# EAGLE design monsterbadge (EAGLE 5.12)
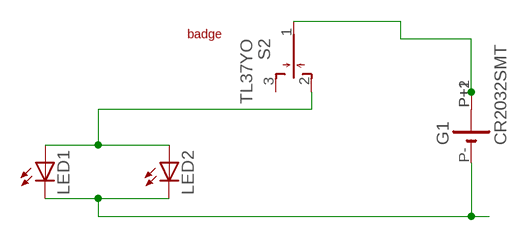
[diagram p0: schematic, sheet 1]

## Parts
G1  CR2032SMT  [CR2032-SMT]
LED1  LED5MM  [LED5MM]
LED2  LED5MM  [LED5MM]
S2  TL37YO  [TL3XYO]
U$1  BADGEPIN  [BADGEPIN]

## Nets
0V: G1.P-(-) LED1.K(C) LED2.K(C)
+3V: LED1.A LED2.A S2.2(O1)
N$3: G1.P+1(+) G1.P+2(+1) S2.1(C)
Unconnected: S2.3(O2)

## Library data of the parts
G1 = matt:CR2032: NC ACCU Varta
LED1 LED2 = matt led:LED: LED OSRAM: - CHIPLED LG R971, LG N971, LY N971, LG Q971, LY Q971, LO R971, LY R971 LH N974, LH R974 LS Q976, LO Q976, LY Q976 LO Q996 - Hyper CHIPLED LW Q18S LB Q993, LB Q99A, LB R99A - SideLED LS A670, LO A670, LY A670, LG A670, LP A670 LB A673, LV A673, LT A673, LW A673 LH A674 LY A675 LS A676, LA A676, LO A676, LY A676, LW A676 LS A679, LY A679, LG A679 - Hyper Micro SIDELED® LS Y876, LA Y876, LO Y876, LY Y876 LT Y87S - SmartLED LW L88C, LW L88S LB L89C, LB L89S, LG L890 LS L89K, LO L89K, LY L89K LS L896, LA L896, LO L896, LY L896 - TOPLED LS T670, LO T670, LY T670, LG T670, LP T670 LSG T670, LSP T670, LSY T670, LOP T670, LYG T670 LG T671, LOG T671, LSG T671 LB T673, LV T673, LT T673, LW T673 LH T674 LS T676, LA T676, LO T676, LY T676, LB T676, LH T676, LSB T676, LW T676 LB T67C, LV T67C, LT T67C, LS T67K, LO T67K, LY T67K, LW E67C LS E67B, LA E67B, LO E67B, LY E67B, LB E67C, LV E67C, LT E67C LW T67C LS T679, LY T679, LG T679 LS T770, LO T770, LY T770, LG T770, LP T770 LB T773, LV T773, LT T773, LW T773 LH T774 LS E675, LA E675, LY E675, LS T675 LS T776, LA T776, LO T776, LY T776, LB T776 LHGB T686 LT T68C, LB T68C - Hyper Mini TOPLED® LB M676 - Mini TOPLED Santana® LG M470 LS M47K, LO M47K, LY M47K Source: http://www.osram.convergy.de LUXEON: - LUMILED® LXK2-PW12-R00, LXK2-PW12-S00, LXK2-PW14-U00, LXK2-PW14-V00 LXK2-PM12-R00, LXK2-PM12-S00, LXK2-PM14-U00 LXK2-PE12-Q00, LXK2-PE12-R00, LXK2-PE12-S00, LXK2-PE14-T00, LXK2-PE14-U00 LXK2-PB12-K00, LXK2-PB12-L00, LXK2-PB12-M00, LXK2-PB14-N00, LXK2-PB14-P00, LXK2-PB14-Q00 LXK2-PR12-L00, LXK2-PR12-M00, LXK2-PR14-Q00, LXK2-PR14-R00 LXK2-PD12-Q00, LXK2-PD12-R00, LXK2-PD12-S00 LXK2-PH12-R00, LXK2-PH12-S00 LXK2-PL12-P00, LXK2-PL12-Q00, LXK2-PL12-R00 Source: www.luxeon.com KINGBRIGHT: KA-3528ASYC Source: www.kingbright.com
S2 = matt:TL37YO: TINY SWITCH MOM OFF MOM Source: http://www2.produktinfo.conrad.com/datenblaetter/700000-724999/705152-da-01-de-Subminiaturschalter_TL_36YO.pdf
U$1 = matt:BADGEPIN

## Board
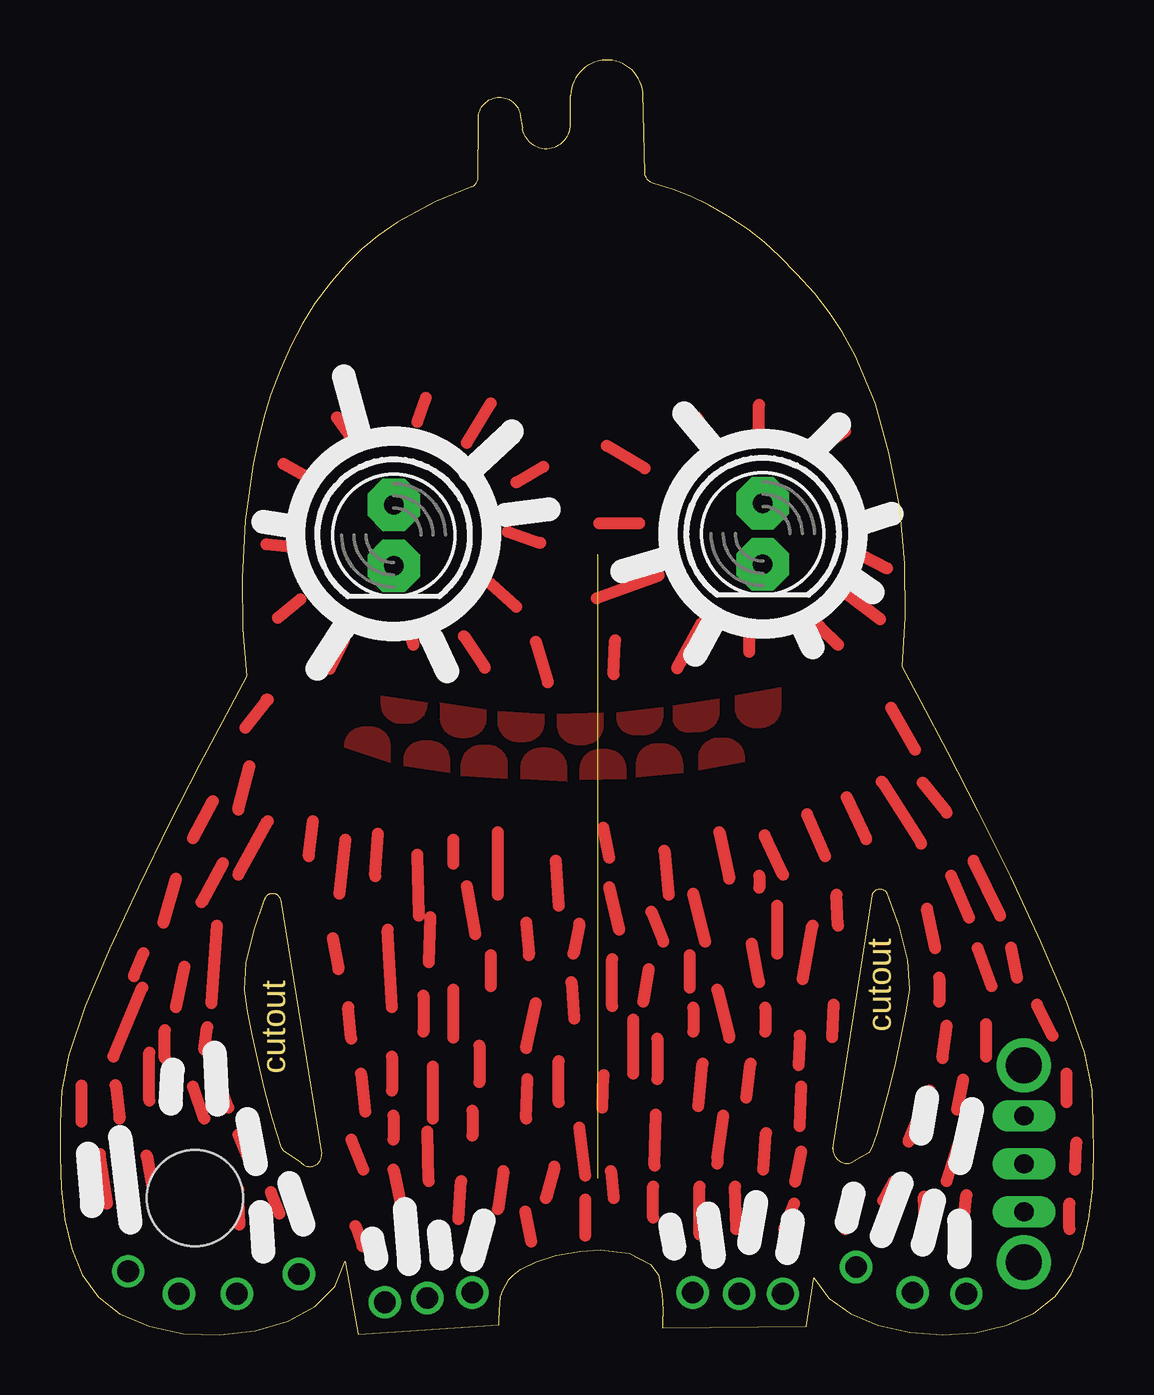
[diagram p1: board, top side]
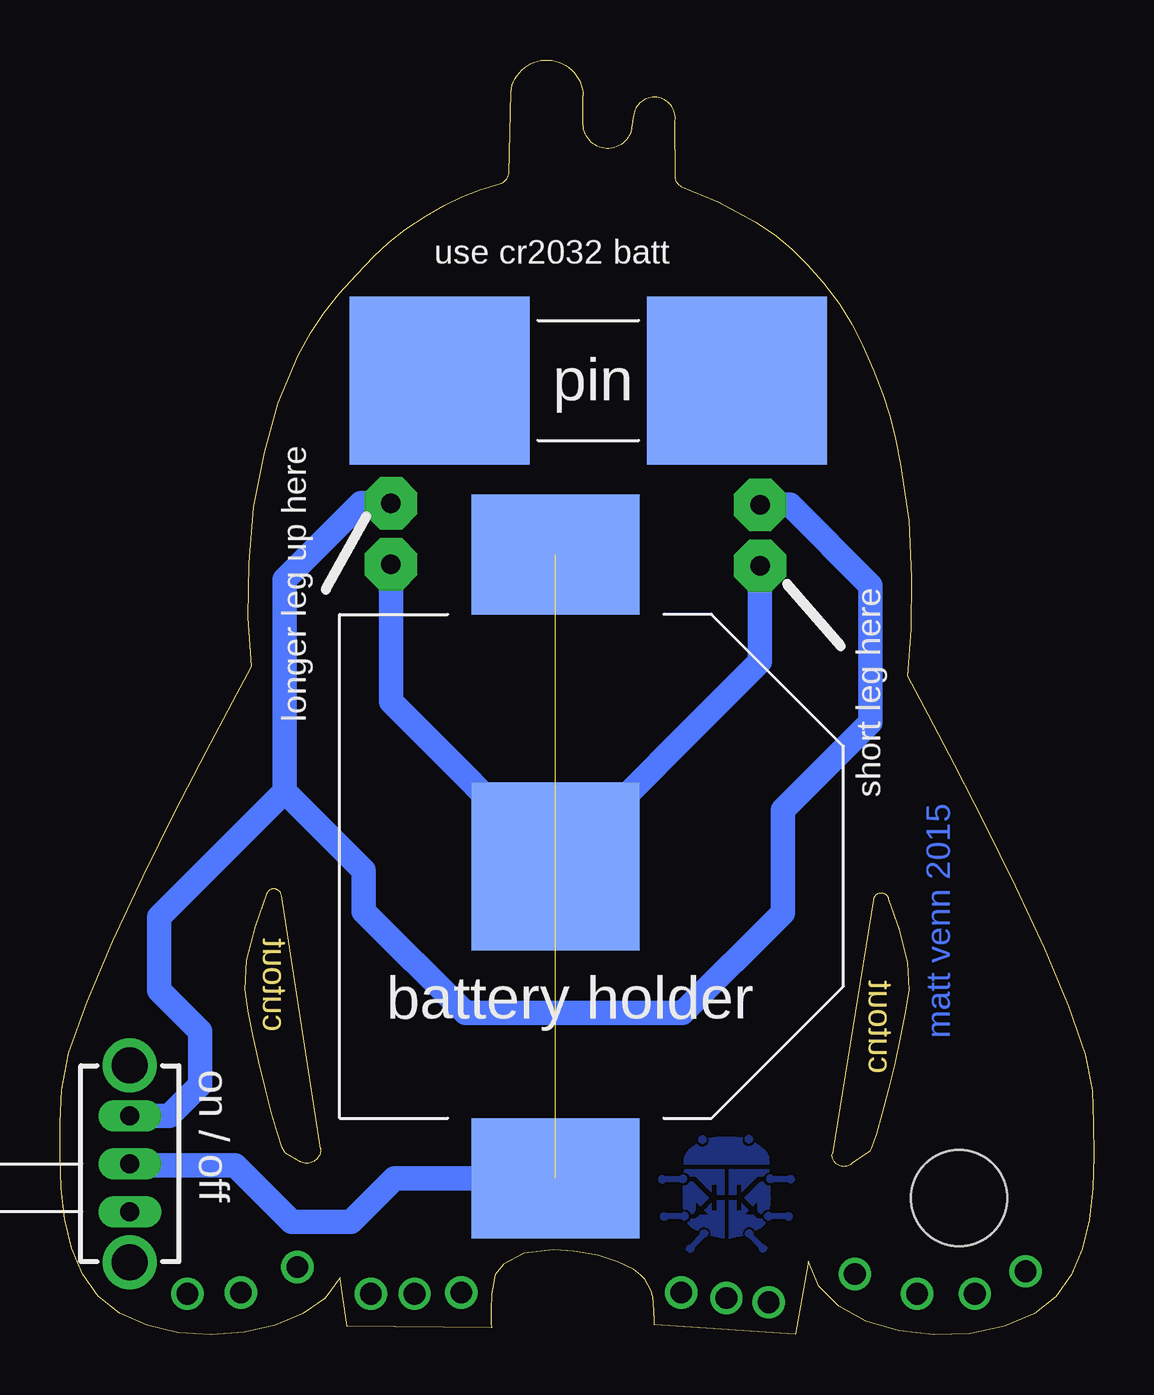
[diagram p2: board, bottom side, seen from below]

Size 43.09 x 53.14 mm. Coordinates in mm from the lower left corner, seen from the top.
Outline: 17.18,47.87 15.66,47.24 14.08,46.39 13.26,45.82 12.58,45.26 11.95,44.64 11.3,43.88 10.61,42.99 10.09,42.14 9.64,41.25 9.18,40.21 8.79,39.2 8.5,38.29 8.28,37.37 8.06,36.3 7.71,33.94 7.6,31.55 7.62,29.43 7.77,27.46 6.92,25.87 5.81,23.76 4.55,21.32 3.27,18.71 2.07,16.11 1.06,13.71 0.35,11.68 0.07,10.2 0.02,8.84 0,7.47 0.05,6.11 0.2,4.81 0.48,3.6 0.93,2.51 1.59,1.6 2.49,0.89 3.74,0.35 5.16,0.06 6.66,0 8.13,0.17 9.49,0.57 10.63,1.19 11.46,2.02 11.89,3.06 12.43,0.02 18.31,0.43 18.31,0.6 18.32,1.04 18.37,1.6 18.46,1.87 18.71,2.32 18.88,2.5 19.19,2.73 19.84,3.05 20.68,3.33 21.68,3.49 22.52,3.54 23.74,3.41 24.61,2.95 24.95,2.52 25.1,1.69 25.13,1.04 25.12,0.52 25.11,0.3 31.11,0.35 31.42,2.38 32.05,1.54 32.97,0.88 34.12,0.4 35.42,0.1 36.79,0.01 38.16,0.1 39.46,0.4 40.6,0.9 41.5,1.61 42.16,2.53 42.61,3.61 42.89,4.82 43.04,6.12 43.09,7.48 43.08,8.85 43.03,10.21 42.72,11.76 41.97,13.89 40.9,16.41 39.63,19.12 38.29,21.82 37.01,24.31 35.91,26.39 35.1,27.87 35.24,29.93 35.22,32.15 35.01,34.48 34.56,36.78 34,38.85 33.16,40.82 32.62,41.8 32.08,42.62 31.46,43.4 30.71,44.23 30.02,44.95 29.37,45.54 28.68,46.09 27.85,46.63 27.06,47.09 26.33,47.45 25.57,47.74 24.7,48
Outline: 33.06,7.21 33.72,7.58 33.85,7.83 34.04,8.41 34.28,9.24 34.55,10.25 34.82,11.35 35.06,12.46 35.27,13.51 35.41,14.41 35.33,15.61 34.96,17.03 34.47,18.4 arc149 33.86,18.32 32.22,7.77
Outline: 10.04,7.19 9.31,7.69 9.24,7.81 9.05,8.39 8.81,9.22 8.54,10.23 8.28,11.33 8.03,12.44 7.83,13.49 7.69,14.39 7.75,15.51 8.09,16.85 8.54,18.16 arc-3 8.55,18.21 arc-148 9.19,18.14 10.9,7.55
Outline: 10.04,7.19 arc142 10.91,7.53
Outline: 32.22,7.77 arc116 33.06,7.21
Outline: 17.18,47.86 arc51 17.43,48.19
Outline: 24.7,48 arc-51 24.38,48.39
Outline: 17.43,48.21 17.45,50.61 arc-180 19.19,50.82
Outline: 24.38,48.4 24.3,51.79 arc173 21.29,51.66
Outline: 19.18,50.83 19.27,50.3
Outline: 19.26,50.27 arc173 21.28,50.56
Outline: 21.29,50.57 21.29,51.65
Copper layers (1*16): Top 0.035mm / dielectric 1.5mm / Bottom 0.035mm
Design rules "default": minimum track width 10mil, minimum drill 24mil, track to track 8mil, track to pad 8mil, pad to pad 8mil, via to via 8mil, smd to smd 8mil, copper to edge 40mil, drill to drill 8mil, minimum pad ring 10mil, minimum via ring 8mil, stop-mask expansion 4mil, vias tented up to drill 0mil, thermal gap 10mil
Holes 4 mm at 5.62,5.71

### Footprints (pad centres in the part's own frame; a part is rotated, then mirrored left to right if it is on the bottom)
CR2032-SMT = smd 5 x 7: P+1 -13,0; P+2 13,0 | smd 7 x 7: P- 0,0
LED5MM = drill 0.813 pad 2.184 octagon: A -1.27,0; K 1.27,0
TL3XYO = drill 0.8 long: 1 0,0; 2 -2,0; 3 2,0 | drill 1.5 round: P$4 4.1,0; P$5 -4.1,0
BADGEPIN = smd 7.5 x 7: P$1 -6.1,0; P$2 6.3,0

### Placement (x,y rotation side)
G1  22.43,19.54 90 bottom
LED1  13.91,33.33 270 top
LED2  29.29,33.4 270 top
S2  40.18,7.14 270 bottom
U$1  21.17,39.78 0 bottom

### Tracks (layer width: path | path; a pad name or v marks a point on that pad's centre or on a via)
0V
  Bottom 1.016: LED1.K 13.91,28.06 G1.P- 29.29,26.4 LED2.K
+3V
  Bottom 1.016: LED2.A 30.54,34.67 33.73,31.48 33.73,22.66 | S2.2 38.54,9.14 37.25,10.42 37.25,12.66 38.96,14.36 38.96,17.42 33.73,22.66 | LED1.A 12.67,34.6 9.31,31.25 9.31,25.54 12.96,21.89 12.96,17.6 17.14,13.42 26.2,13.42 30.43,17.66 30.43,19.36 33.73,22.66
N$1
  Top 0.5: 11.65,18.39 11.9,20.64
N$2
  Top 0.5: 16.4,19.64 16.4,20.64
N$3  (1 unrouted)
  Bottom 1.016: G1.P+1 29.14,6.54 30.96,4.72 33.43,4.72 35.78,7.07 40.11,7.07 S2.1
N$4
  pour Top: 11.84,24.54 arc-90 12.67,25.36 12.96,25.36 arc-90 13.78,24.54 13.78,23.83 11.84,24.48
  pour Top: 15.31,26.3 arc-90 14.49,25.48 14.2,25.48 arc-90 13.37,26.3 13.37,26.66 15.31,26.36
N$5
  pour Top: 14.31,23.95 arc-90 15.14,24.77 15.43,24.77 arc-90 16.25,23.95 16.25,23.42 14.31,23.72
  pour Top: 17.78,25.72 arc-90 16.96,24.89 16.67,24.89 arc-90 15.84,25.72 15.84,26.36 17.78,26.07
N$6
  pour Top: 16.72,23.77 arc-90 17.55,24.6 17.84,24.6 arc-90 18.67,23.77 18.67,23.19 16.72,23.3
  pour Top: 20.2,25.54 arc-90 19.37,24.72 19.08,24.72 arc-90 18.25,25.54 18.25,26.01 20.2,25.89
N$7
  pour Top: 19.2,23.66 arc-90 20.02,24.48 20.31,24.48 arc-90 21.14,23.66 21.14,23.07 19.2,23.19
  pour Top: 22.67,25.42 arc-90 21.84,24.6 21.55,24.6 arc-90 20.72,25.42 20.72,25.89 22.67,25.95
N$8
  pour Top: 21.67,23.6 arc-90 22.49,24.42 22.78,24.42 arc-90 23.61,23.6 23.61,23.19 21.67,23.13
  pour Top: 25.14,25.72 arc-90 24.25,25.01 23.96,25.01 arc-90 23.2,25.72 23.2,25.95 25.14,26.19
N$9
  pour Top: 24.02,23.83 arc-90 24.84,24.66 25.14,24.66 arc-90 25.96,23.83 25.96,23.42 24.02,23.25
  pour Top: 27.49,26.01 arc-90 26.67,25.13 26.31,25.13 arc-90 25.55,25.6 25.55,26.25 27.49,26.54
N$10
  pour Top: 26.61,24.07 arc-90 27.43,24.89 27.72,24.89 arc-90 28.55,24.07 28.55,23.89 26.61,23.54
  pour Top: 30.08,26.25 arc-90 29.25,25.3 28.96,25.3 arc-90 28.14,26.19 28.14,26.66 30.08,27.01
N$11
  Top 0.5: 11.25,27.78 11.84,28.95
N$12
  Top 0.5: 9.08,29.89 10.02,30.66
N$13
  Top 0.5: 9.67,32.83 8.61,32.95
N$14
  Top 0.5: 9.31,36.3 10.25,35.78
N$15
  Top 0.5: 12.14,37.42 11.55,38.25
N$16
  Top 0.5: 14.9,38.07 15.25,39.07
N$17
  Top 0.5: 16.96,37.19 17.96,38.83
N$18
  Top 0.5: 19.02,35.54 20.14,36.19
N$19
  Top 0.5: 18.67,33.48 20.02,33.01
N$20
  Top 0.5: 19.02,30.36 17.96,31.3
N$21
  Top 0.5: 24.37,36.13 22.78,37.07
N$22
  Top 0.5: 27.31,36.83 26.55,38.25
N$23
  Top 0.5: 29.14,37.72 29.14,38.78
N$24
  Top 0.5: 31.73,37.01 32.73,37.66
N$25
  Top 0.5: 33.49,34.07 34.49,34.25
N$26
  Top 0.5: 33.37,32.54 34.49,31.95
N$27
  Top 0.5: 32.67,31.01 34.2,29.83
N$28
  Top 0.5: 31.67,29.54 32.43,28.78
N$29
  Top 0.5: 28.73,29.13 28.73,28.48
N$30
  Top 0.5: 25.73,27.79 26.78,29.72
N$31
  Top 0.5: 22.37,30.72 24.96,31.66
N$32
  Top 0.5: 16.84,29.13 17.71,27.82
N$33
  Top 0.5: 14.55,29.48 14.72,28.78
N$34
  Top 0.5: 7.43,21.89 7.9,23.72
N$35
  Top 0.5: 10.37,19.95 10.55,21.42
N$36
  Top 0.5: 13.14,19.13 13.25,20.89
N$37
  Top 0.5: 14.96,17.48 14.9,20.01
N$38
  Top 0.5: 18.25,18.36 18.25,20.95
N$39
  Top 0.5: 20.67,19.78 20.78,17.89
N$40
  Top 0.5: 23.31,16.89 22.9,18.66
N$41
  Top 0.5: 25.2,20.19 25.37,18.36
N$42
  Top 0.5: 27.49,20.95 27.9,19.01
N$43
  Top 0.5: 30.14,19.19 29.37,20.83
N$44
  Top 0.5: 31.9,19.95 31.14,21.72
N$45
  Top 0.5: 32.78,22.42 33.61,20.66
N$46
  Top 0.5: 34.25,23.07 35.9,20.48
N$47
  Top 0.5: 36.96,21.78 35.96,23.01
N$48
  Top 0.5: 39.2,17.48 38.08,19.78
N$49
  Top 0.5: 36.49,16.13 36.14,17.78
N$50
  Top 0.5: 38.84,14.54 38.25,16.13
N$51
  Top 0.5: 36.78,11.54 36.96,12.89
N$52
  Top 0.5: 35.37,8.07 36.25,10.19
N$53
  Top 0.5: 36.96,6.42 37.43,7.89
N$54
  Top 0.5: 34.78,6.42 34.31,5.6
N$55
  Top 0.5: 36.08,4.25 36.02,5.77
N$56
  Top 0.5: 41.37,12.48 40.73,13.78
N$57
  Top 0.5: 41.96,9.72 41.96,10.89
N$58
  Top 0.5: 42.31,6.89 42.37,8.01
N$59
  Top 0.5: 38.61,11.6 38.61,12.95
N$60
  Top 0.5: 37.55,3.54 37.78,5.83
N$61
  Top 0.5: 32.73,4.42 33.02,5.83
N$62
  Top 0.5: 42.08,4.42 42.08,5.48
N$63
  Top 0.5: 30.96,14.83 31.37,17.07
N$64
  Top 0.5: 29.14,14.72 28.84,16.3
N$65
  Top 0.5: 26.25,14.48 26.25,15.83
N$66
  Top 0.5: 21.31,14.72 21.43,13.19
N$67
  Top 0.5: 17.96,14.54 17.96,15.83
N$68
  Top 0.5: 15.43,17.42 15.37,15.54
N$69
  Top 0.5: 13.84,13.66 13.67,16.89
N$70
  Top 0.5: 11.37,16.54 11.61,15.25
N$71
  Top 0.5: 12.14,12.36 12.02,13.66
N$72
  Top 0.5: 12.55,10.89 12.72,9.3
N$73
  Top 0.5: 15.55,9.01 15.55,11.19
N$74
  Top 0.5: 17.49,12.07 17.49,10.54
N$75
  Top 0.5: 20.78,9.72 20.78,11.42
N$76
  Top 0.5: 22.61,9.48 22.67,10.83
N$77
  Top 0.5: 24.9,12.36 24.9,10.66
N$78
  Top 0.5: 26.61,9.54 26.78,11.3
N$79
  Top 0.5: 28.61,9.89 28.78,11.3
N$80
  Top 0.5: 30.84,12.48 30.78,11.25
N$81
  Top 0.5: 30.84,8.72 30.9,10.36
N$82
  Top 0.5: 30.2,4.42 30.61,5.48
N$83
  Top 0.5: 28.2,4.42 28.14,6.19
N$84
  Top 0.5: 26.67,4.19 26.67,6.19
N$85
  Top 0.5: 24.73,4.89 24.73,6.19
N$86
  Top 0.5: 22.96,6.83 23.08,5.72
N$87
  Top 0.5: 24.78,7.07 24.84,9.19
N$88
  Top 0.5: 29.31,6.89 29.43,8.42
N$89
  Top 0.5: 32.2,12.42 32.25,13.78
N$90
  Top 0.5: 15.37,6.42 15.31,8.48
N$91
  Top 0.5: 13.9,6.89 14.2,5.48
N$92
  Top 0.5: 12.31,4.54 12.61,3.72
N$93
  Top 0.5: 16.61,4.83 16.73,6.42
N$94
  Top 0.5: 18.49,6.83 18.25,5.25
N$95
  Top 0.5: 20.61,7.01 20.25,5.72
N$96
  Top 0.5: 17.2,9.36 17.2,8.3
N$97
  Top 0.5: 1.96,5.48 1.67,7.54
N$98
  Top 0.5: 3.61,7.48 3.96,5.48
N$99
  Top 0.5: 5.84,4.83 5.96,6.3
N$100
  Top 0.5: 7.49,4.6 7.43,6.07
N$101
  Top 0.5: 8.78,5.95 9.14,5.07
N$102
  Top 0.5: 2.22,11.6 3.43,14.48
N$103
  Top 0.5: 3.72,9.77 3.72,11.77
N$104
  Top 0.5: 6.02,9.01 5.55,10.36
N$105
  Top 0.5: 2.31,10.42 2.49,9.01
N$106
  Top 0.5: 6.31,13.83 6.55,17.07
N$107
  Top 0.5: 7.02,9.48 6.31,11.42
N$108
  Top 0.5: 7.43,8.36 7.96,7.07
N$109
  Top 0.5: 4.31,17.19 4.84,19.01
N$110
  Top 0.5: 6.78,19.66 5.9,18.04
N$111
  Top 0.5: 4.84,13.66 5.19,15.36
N$112
  Top 0.5: 3.08,14.95 3.47,15.91
N$113
  Top 0.5: 4.37,11.54 4.37,12.72
N$114
  Top 0.5: 6.02,11.89 6.14,12.83
N$115
  Top 0.5: 7.43,19.19 8.67,21.42
N$116
  Top 0.5: 5.55,20.72 6.37,22.25
N$117
  Top 0.5: 8.61,26.48 8.67,26.48 7.72,25.3
N$118
  Top 0.5: 13.84,11.6 13.84,10.19
N$119
  Top 0.5: 17.31,16.72 16.96,18.72
N$120
  Top 0.5: 19.43,17.19 19.55,15.83
N$121
  Top 0.5: 19.43,11.95 19.84,13.83
N$122
  Top 0.5: 19.43,9.01 19.49,10.66
N$123
  Top 0.5: 23.02,13.72 23.02,15.66
N$124
  Top 0.5: 24.31,13.89 24.55,15.25
N$125
  Top 0.5: 32.43,17.07 32.37,18.36
N$126
  Top 0.5: 19.84,28.89 20.34,27.22
N$127
  Top 0.5: 23.08,27.54 23.14,28.95
N$128
  Top 0.5: 22.49,33.83 24.14,33.83
N$129
  Top 0.5: 16.4,12.39 16.4,14.39
N$130
  Top 0.5: 27.4,14.39 27.9,12.39
N$131
  Top 0.5: 26.9,16.39 26.4,18.39
N$132
  Top 0.5: 29.15,19.14 29.15,18.64
N$133
  Top 0.5: 29.9,15.89 29.9,17.89
N$134
  Top 0.5: 29.4,13.64 29.4,12.64
N$135
  Top 0.5: 15.15,14.14 15.15,12.64
N$136
  Top 0.5: 12.65,6.89 12.15,8.14
N$137
  Top 0.5: 13.9,9.14 13.9,8.14
N$138
  Top 0.5: 21.9,6.64 21.65,8.64
N$139
  Top 0.5: 22.9,19.89 22.65,21.14
N$140
  Top 0.5: 0.9,8.89 0.9,10.39
N$141
  Top 0.5: 19.65,3.89 19.4,5.14
N$142
  Top 0.5: 21.9,4.14 21.9,5.64
N$143
  Top 0.5: 27.4,7.14 27.4,7.39 27.65,9.14
N$144
  Top 0.5: 30.65,6.39 30.9,7.64
N$145
  Top 0.5: 23.9,13.14 23.9,12.64 23.9,10.89
N$146
  Top 0.5: 26.4,13.64 26.4,12.64
N$147
  Top 0.5: 21.65,17.14 21.4,15.89
N$148
  Top 0.5: 24.65,17.64 25.15,16.39
N$149
  Top 0.5: 37.9,17.39 37.15,19.14
N$150
  Top 0.5: 36.65,14.89 36.65,13.89
N$151
  Top 0.5: 39.9,14.89 39.65,16.14
N$152
  Top 0.5: 37.4,9.39 37.65,10.64
N$153
  Top 0.5: 34.65,26.14 35.65,24.39
N$154
  Top 0.5: 2.9,5.14 2.9,7.14
N$155
  pour Bottom: 16.25,4.4 16.18,4.39 16.12,4.35 16.08,4.3 16.07,4.23 16.08,4.17 16.12,4.11 16.18,4.07 16.25,4.06 16.65,3.64 16.64,3.6 16.65,3.56 16.67,3.52 16.69,3.49 16.75,3.45 16.81,3.43 16.88,3.44 16.94,3.48 16.98,3.54 16.99,3.6 16.98,3.67 16.94,3.72 16.89,3.76 16.82,3.78 16.41,4.21 16.41,4.28 16.37,4.35 16.31,4.39
N$156
  pour Bottom: 17.06,5.13 17.03,5.13 17,5.12 16.97,5.1 16.94,5.08 16.92,5.05 16.9,5.03 16.89,4.99 16.89,4.96 16.89,4.92 16.9,4.89 16.92,4.86 16.94,4.84 16.97,4.81 17,4.8 17.03,4.79 17.06,4.78 17.1,4.79 17.14,4.8 17.17,4.82 17.19,4.84 17.77,4.84 17.8,4.81 17.83,4.79 17.87,4.77 17.91,4.77 17.95,4.77 17.98,4.78 18.01,4.8 18.03,4.82 18.05,4.85 18.07,4.88 18.08,4.91 18.08,4.94 18.08,4.98 18.07,5.01 18.05,5.04 18.03,5.06 18.01,5.09 17.98,5.1 17.95,5.11 17.91,5.12 17.84,5.1 17.79,5.07 17.2,5.07 17.17,5.09 17.14,5.11 17.1,5.13
N$157
  pour Bottom: 17.07,6.91 17.07,6.9 17.07,6.88 17.07,6.83 17.08,6.78 17,6.76 16.94,6.73 16.88,6.68 16.84,6.61 16.6,6.61 15.93,5.95 15.93,6.28 15.71,6.28 15.71,5.83 15.4,5.83 15.4,6.91
N$158
  pour Bottom: 16.84,6.39 16.89,6.32 16.94,6.27 17.02,6.23 17.1,6.22 17.11,6.22 17.12,5.98 17.12,5.73 17.11,5.47 17.1,5.23 17.05,5.23 16.96,5.22 16.89,5.18 16.83,5.13 16.79,5.06 16.71,5.06 16.6,5.17 16.6,5.57 16.4,5.37 16.04,5.72 16.71,6.39
N$159
  pour Bottom: 15.71,5.61 15.71,5.17 15.93,5.17 15.93,5.5 16.23,5.2 16.04,5.01 16.42,5.01 16.6,4.83 16.79,4.83 16.82,4.79 16.86,4.75 16.9,4.71 16.96,4.69 16.95,4.69 16.87,4.58 16.77,4.49 16.64,4.41 16.5,4.33 16.46,4.4 16.4,4.45 16.33,4.49 16.25,4.5 16.14,4.48 16.05,4.42 15.99,4.33 15.97,4.22 15.98,4.14 15.86,4.11 15.75,4.09 15.66,4.07 15.57,4.05 15.5,4.04 15.45,4.03 15.41,4.02 15.4,4.02 15.4,5.61
N$160
  pour Bottom: 17.13,6.68 17.1,6.68 17.06,6.67 17.03,6.65 17.01,6.63 16.99,6.6 16.97,6.57 16.96,6.54 16.96,6.51 16.96,6.47 16.97,6.44 16.99,6.41 17.01,6.39 17.03,6.36 17.06,6.35 17.1,6.34 17.13,6.33 17.2,6.35 17.26,6.39 17.84,6.39 17.86,6.36 17.9,6.34 17.94,6.32 17.98,6.32 18.01,6.32 18.04,6.33 18.07,6.35 18.1,6.37 18.12,6.4 18.14,6.42 18.15,6.46 18.15,6.49 18.15,6.53 18.14,6.56 18.12,6.59 18.1,6.61 18.07,6.64 18.04,6.65 18.01,6.66 17.98,6.67 17.91,6.65 17.86,6.62 17.27,6.62 17.24,6.64 17.21,6.66 17.17,6.68
N$161
  pour Bottom: 14.37,4.4 14.3,4.39 14.24,4.35 14.2,4.28 14.2,4.21 13.79,3.78 13.73,3.76 13.67,3.72 13.63,3.67 13.62,3.6 13.64,3.54 13.68,3.48 13.73,3.44 13.8,3.43 13.86,3.45 13.92,3.49 13.95,3.52 13.96,3.56 13.97,3.6 13.96,3.64 14.36,4.06 14.43,4.07 14.49,4.11 14.53,4.17 14.54,4.23 14.53,4.3 14.49,4.35 14.43,4.39
N$162
  pour Bottom: 13.57,5.13 13.53,5.13 13.5,5.11 13.46,5.09 13.44,5.07 12.85,5.07 12.79,5.1 12.72,5.12 12.69,5.11 12.66,5.1 12.63,5.09 12.58,5.04 12.56,5.01 12.55,4.98 12.55,4.94 12.55,4.91 12.56,4.87 12.58,4.85 12.6,4.82 12.63,4.8 12.66,4.78 12.69,4.77 12.72,4.77 12.77,4.77 12.81,4.79 12.84,4.81 12.87,4.84 13.44,4.84 13.47,4.82 13.5,4.8 13.53,4.79 13.57,4.78 13.61,4.79 13.64,4.8 13.67,4.81 13.69,4.83 13.71,4.86 13.73,4.89 13.74,4.92 13.74,4.96 13.74,4.99 13.73,5.02 13.71,5.05 13.69,5.08 13.67,5.1 13.64,5.12 13.61,5.13
N$163
  pour Bottom: 13.55,6.91 13.54,6.9 13.54,6.88 13.54,6.83 13.53,6.78 13.61,6.76 13.68,6.73 13.73,6.68 13.77,6.61 14.01,6.61 14.68,5.95 14.68,6.28 14.9,6.28 14.9,5.83 15.21,5.83 15.21,6.91
N$164
  pour Bottom: 13.77,6.39 13.73,6.32 13.67,6.27 13.6,6.23 13.51,6.22 13.5,6.22 13.49,5.98 13.49,5.73 13.5,5.47 13.52,5.23 13.57,5.23 13.65,5.22 13.72,5.18 13.78,5.13 13.83,5.06 13.9,5.06 14.01,5.17 14.01,5.57 14.21,5.37 14.57,5.72 13.9,6.39
N$165
  pour Bottom: 14.9,5.61 14.9,5.17 14.68,5.17 14.68,5.5 14.38,5.2 14.57,5.01 14.19,5.01 14.01,4.83 13.82,4.83 13.79,4.79 13.75,4.75 13.71,4.71 13.66,4.69 13.66,4.69 13.74,4.58 13.84,4.49 13.97,4.41 14.11,4.33 14.15,4.4 14.21,4.45 14.28,4.49 14.37,4.5 14.47,4.48 14.56,4.42 14.62,4.33 14.64,4.22 14.63,4.14 14.75,4.11 14.86,4.09 14.96,4.07 15.04,4.05 15.11,4.04 15.17,4.03 15.2,4.02 15.21,4.02 15.21,5.61
N$166
  pour Bottom: 13.48,6.68 13.44,6.68 13.41,6.66 13.37,6.64 13.35,6.62 12.76,6.62 12.7,6.65 12.63,6.67 12.6,6.66 12.57,6.65 12.54,6.64 12.49,6.59 12.47,6.56 12.46,6.53 12.46,6.49 12.46,6.46 12.47,6.42 12.49,6.4 12.51,6.37 12.54,6.35 12.57,6.33 12.6,6.32 12.63,6.32 12.68,6.32 12.72,6.34 12.75,6.36 12.78,6.39 13.35,6.39 13.38,6.37 13.41,6.35 13.44,6.34 13.48,6.33 13.52,6.34 13.55,6.35 13.58,6.36 13.6,6.39 13.62,6.41 13.64,6.44 13.65,6.47 13.65,6.51 13.65,6.54 13.64,6.57 13.62,6.6 13.6,6.63 13.58,6.65 13.55,6.67 13.52,6.68
N$167
  pour Bottom: 16.49,8.14 16.48,8.11 16.47,8.08 16.46,8.05 16.44,8.02 16.41,8 16.38,7.98 16.35,7.97 16.31,7.97 16.28,7.97 16.25,7.98 16.22,8 16.19,8.02 16.17,8.05 16.15,8.08 16.14,8.11 16.14,8.14 16.14,8.18 16.15,8.21 16.17,8.24 16.19,8.27 16.22,8.29 16.25,8.3 16.28,8.31 16.31,8.32 16.35,8.31 16.38,8.3 16.41,8.29 16.44,8.27 16.46,8.24 16.47,8.21 16.48,8.18
N$168
  pour Bottom: 14.55,8.17 14.55,8.13 14.54,8.1 14.52,8.07 14.5,8.04 14.48,8.02 14.45,8.01 14.41,8 14.38,7.99 14.34,8 14.31,8.01 14.28,8.02 14.26,8.04 14.24,8.07 14.22,8.1 14.21,8.13 14.21,8.17 14.21,8.2 14.22,8.23 14.24,8.26 14.26,8.29 14.28,8.31 14.31,8.33 14.34,8.34 14.38,8.34 14.41,8.34 14.45,8.33 14.48,8.31 14.5,8.29 14.52,8.26 14.54,8.23 14.55,8.2
N$169
  pour Bottom: 14.89,8.25 14.65,8.23 14.66,8.14 14.64,8.04 14.58,7.95 14.49,7.89 14.38,7.87 14.3,7.88 14.23,7.91 14.18,7.96 14.13,8.03 14,7.94 13.89,7.86 13.78,7.78 13.69,7.7 13.62,7.61 13.57,7.5 13.54,7.37 13.53,7.21 13.53,7.14 13.53,7.1 17.09,7.1 17.09,7.14 17.09,7.21 17.08,7.36 17.05,7.48 17,7.58 16.94,7.66 16.86,7.74 16.77,7.81 16.67,7.89 16.55,7.97 16.51,7.92 16.45,7.88 16.39,7.85 16.32,7.84 16.21,7.87 16.12,7.93 16.06,8.01 16.04,8.12 16.06,8.21 15.89,8.24 15.73,8.25
S$5  (via drill 0.9)
  other vias: 2.84,2.66
S$6  (via drill 0.9)
  other vias: 4.96,1.72
S$7  (via drill 0.9)
  other vias: 7.37,1.72
S$8  (via drill 0.9)
  other vias: 9.96,2.54
S$9  (via drill 0.9)
  other vias: 13.55,1.36
S$10  (via drill 0.9)
  other vias: 15.31,1.54
S$11  (via drill 0.9)
  other vias: 17.2,1.77
S$12  (via drill 0.9)
  other vias: 26.37,1.77
S$13  (via drill 0.9)
  other vias: 28.31,1.72
S$14  (via drill 0.9)
  other vias: 30.14,1.72
S$15  (via drill 0.9)
  other vias: 33.19,2.83
S$16  (via drill 0.9)
  other vias: 35.55,1.77
S$17  (via drill 0.9)
  other vias: 37.78,1.72

### Text on the board
Bottom: matt venn 2015
Dimension: cutout | cutout
bNames: use cr2032 batt | pin | longer leg up here | short leg here | battery holder | on / off